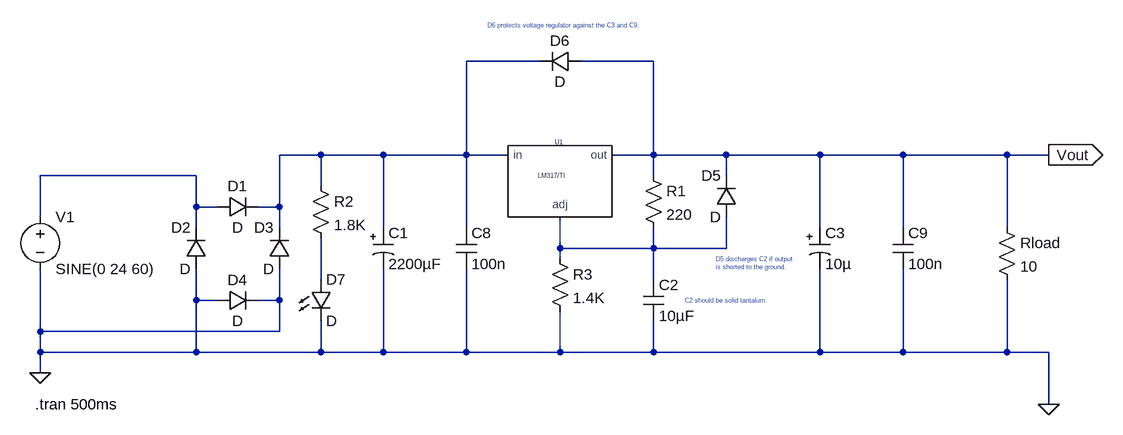
[diagram p0: schematic power-supply-v1.asc]
power-supply-v1.asc, the LTspice schematic file:
Version 4
SHEET 1 1724 680
WIRE 496 -336 384 -336
WIRE 672 -336 560 -336
WIRE 160 -192 96 -192
WIRE 256 -192 160 -192
WIRE 384 -192 384 -336
WIRE 384 -192 256 -192
WIRE 448 -192 384 -192
WIRE 672 -192 672 -336
WIRE 672 -192 608 -192
WIRE 784 -192 672 -192
WIRE 928 -192 784 -192
WIRE 1056 -192 928 -192
WIRE 1216 -192 1056 -192
WIRE 1280 -192 1216 -192
WIRE -32 -160 -272 -160
WIRE 672 -160 672 -192
WIRE 784 -160 784 -192
WIRE 160 -144 160 -192
WIRE -32 -112 -32 -160
WIRE 0 -112 -32 -112
WIRE 96 -112 96 -192
WIRE 96 -112 64 -112
WIRE -272 -96 -272 -160
WIRE -32 -80 -32 -112
WIRE 96 -80 96 -112
WIRE 256 -80 256 -192
WIRE 384 -80 384 -192
WIRE 928 -80 928 -192
WIRE 1056 -80 1056 -192
WIRE 1216 -80 1216 -192
WIRE 528 -48 528 -96
WIRE 672 -48 672 -80
WIRE 672 -48 528 -48
WIRE 784 -48 784 -96
WIRE 784 -48 672 -48
WIRE 528 -32 528 -48
WIRE 160 0 160 -64
WIRE 672 0 672 -48
WIRE -32 32 -32 -16
WIRE 0 32 -32 32
WIRE 96 32 96 -16
WIRE 96 32 64 32
WIRE -272 80 -272 -16
WIRE 96 80 96 32
WIRE 96 80 -272 80
WIRE -272 112 -272 80
WIRE -32 112 -32 32
WIRE -32 112 -272 112
WIRE 160 112 160 64
WIRE 160 112 -32 112
WIRE 256 112 256 -16
WIRE 256 112 160 112
WIRE 384 112 384 -16
WIRE 384 112 256 112
WIRE 528 112 528 48
WIRE 528 112 384 112
WIRE 672 112 672 64
WIRE 672 112 528 112
WIRE 928 112 928 -16
WIRE 928 112 672 112
WIRE 1056 112 1056 -16
WIRE 1056 112 928 112
WIRE 1216 112 1216 0
WIRE 1216 112 1056 112
WIRE 1280 112 1216 112
WIRE -272 144 -272 112
WIRE 1280 192 1280 112
FLAG -272 144 0
FLAG 1280 192 0
FLAG 1280 -192 Vout
IOPIN 1280 -192 Out
SYMBOL diode 0 -96 R270
WINDOW 0 32 32 VTop 2
WINDOW 3 0 32 VBottom 2
SYMATTR InstName D1
SYMBOL diode -16 -16 R180
WINDOW 0 24 64 Left 2
WINDOW 3 24 0 Left 2
SYMATTR InstName D2
SYMBOL diode 112 -16 R180
WINDOW 0 24 64 Left 2
WINDOW 3 24 0 Left 2
SYMATTR InstName D3
SYMBOL diode 0 48 R270
WINDOW 0 32 32 VTop 2
WINDOW 3 0 32 VBottom 2
SYMATTR InstName D4
SYMBOL polcap 240 -80 R0
WINDOW 3 24 56 Left 2
SYMATTR Value 2200µF
SYMATTR InstName C1
SYMATTR Description Capacitor
SYMATTR Type cap
SYMATTR SpiceLine mfg="   ---" pn="   ---" type="   ---"
SYMBOL polcap 912 -80 R0
SYMATTR InstName C3
SYMATTR Value 10µ
SYMATTR Description Capacitor
SYMATTR Type cap
SYMATTR SpiceLine Rser=1.8 Lser=0 mfg="Nichicon" pn="UPR2A100MPH" type="Al electrolytic"
SYMBOL voltage -272 -112 R0
SYMATTR InstName V1
SYMATTR Value SINE(0 24 60)
SYMBOL res 656 -176 R0
SYMATTR InstName R1
SYMATTR Value 220
SYMBOL cap 368 -80 R0
SYMATTR InstName C8
SYMATTR Value 100n
SYMATTR SpiceLine Rser=60.6m Lser=0 mfg="KEMET" pn="C1210C104K5RAC" type="X7R"
SYMBOL cap 1040 -80 R0
SYMATTR InstName C9
SYMATTR Value 100n
SYMATTR SpiceLine Rser=60.6m Lser=0 mfg="KEMET" pn="C1210C104K1RAC" type="X7R"
SYMBOL res 512 -48 R0
SYMATTR InstName R3
SYMATTR Value 1.4K
SYMBOL Misc/LM317-TI 528 -160 R0
SYMATTR InstName U1
SYMBOL diode 800 -96 R180
WINDOW 0 24 64 Left 2
WINDOW 3 24 0 Left 2
SYMATTR InstName D5
SYMBOL cap 656 0 R0
SYMATTR InstName C2
SYMATTR Value 10µF
SYMBOL diode 560 -352 R90
WINDOW 0 0 32 VBottom 2
WINDOW 3 32 32 VTop 2
SYMATTR InstName D6
SYMBOL LED 144 0 R0
SYMATTR InstName D7
SYMBOL res 144 -160 R0
SYMATTR InstName R2
SYMATTR Value 1.8K
SYMBOL res 1200 -96 R0
SYMATTR InstName Rload
SYMATTR Value 10
TEXT -280 192 Left 2 !.tran 500ms
TEXT 768 -32 Left 0 ;D5 discharges C2 if output\nis shorted to the ground.
TEXT 720 32 Left 0 ;C2 should be solid tantalum.
TEXT 416 -392 Left 0 ;D6 protects voltage regulator against the C3 and C9.

The netlist it stands for:
* power-supply-v1.asc
D1 N002 N001 D
D2 0 N002 D
D3 0 N001 D
D4 0 0 D
C1 N001 0 2200µF mfg="   ---" pn="   ---" type="   ---"
C3 Vout 0 10µ Rser=1.8 Lser=0 mfg="Nichicon" pn="UPR2A100MPH" type="Al electrolytic"
V1 N002 0 SINE(0 24 60)
R1 Vout N003 220
C8 N001 0 100n Rser=60.6m Lser=0 mfg="KEMET" pn="C1210C104K5RAC" type="X7R"
C9 Vout 0 100n Rser=60.6m Lser=0 mfg="KEMET" pn="C1210C104K1RAC" type="X7R"
R3 N003 0 1.4K
XU1 N001 N003 Vout LM317/TI  ; pins in adj out
D5 N003 Vout D
C2 N003 0 10µF
D6 Vout N001 D
D7 N004 0 D
R2 N001 N004 1.8K
Rload Vout 0 10
.model D D
.lib standard.dio
.tran 500ms
* D5 discharges C2 if output
* is shorted to the ground.
* C2 should be solid tantalum.
* D6 protects voltage regulator against the C3 and C9.
.lib LM317-TI.sub
.backanno
.end